# EAGLE design LabPowerSupply_CurrentModuleV1.0 (EAGLE 6.3)
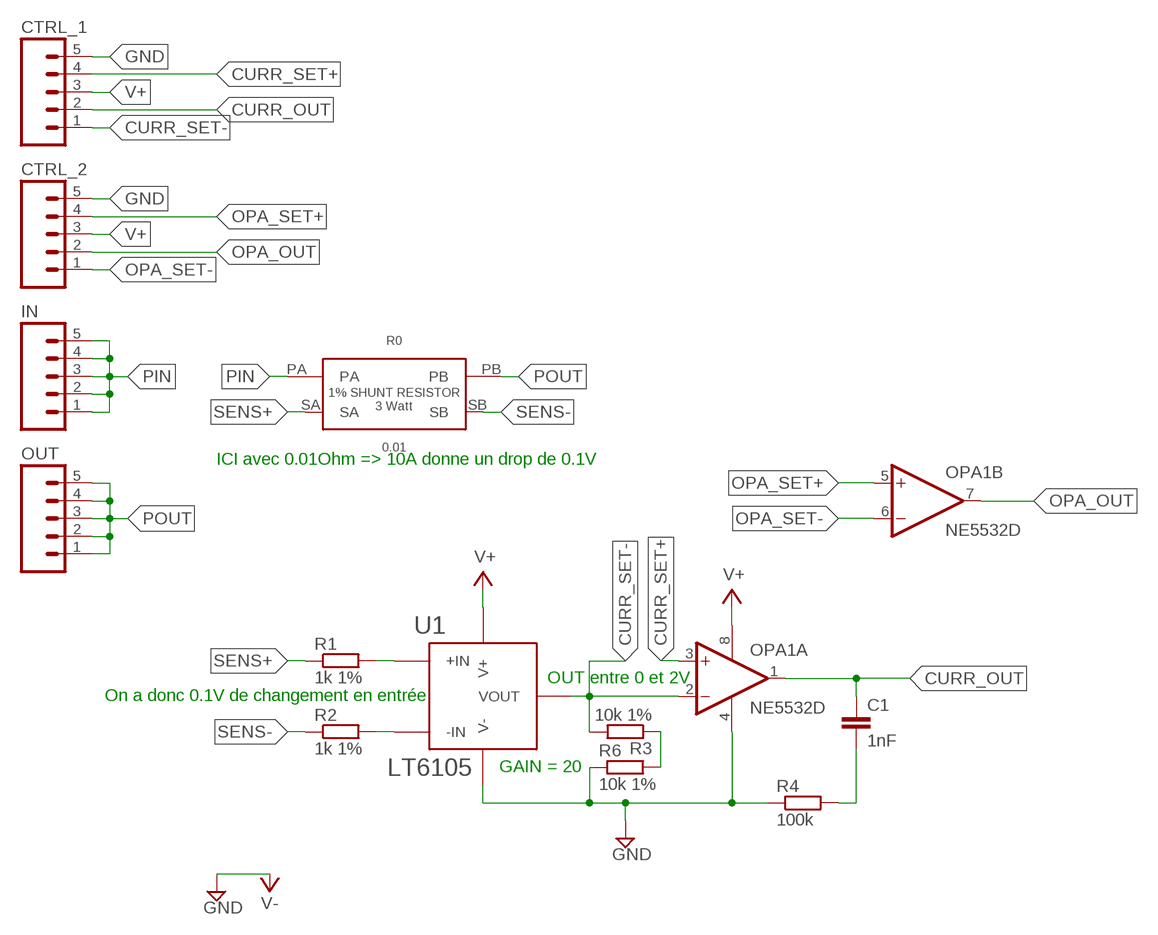
[diagram p0: schematic, sheet 1]

## Parts
C1  1nF  C-EUC1206K  [C1206K]
CTRL_1  M05PTH_LONGPADS  [1X05_LONGPADS]
CTRL_2  M05PTH_LONGPADS  [1X05_LONGPADS]
IN  M05PTH_LONGPADS  [1X05_LONGPADS]
OPA1  NE5532D  [SO08]
OUT  M05PTH_LONGPADS  [1X05_LONGPADS]
R0  0.01  WSL3637R0100FEA  [3637R]
R1  1k 1%  R-EU_R1206  [R1206]
R2  1k 1%  R-EU_R1206  [R1206]
R3  10k 1%  R-EU_R1206  [R1206]
R4  100k  R-EU_R1206  [R1206]
R6  10k 1%  R-EU_R1206  [R1206]
U1  LT6105  LT6105_MSOP_8  [MSOP_8]

## Nets
CURR_OUT: C1.1 CTRL_1.2 OPA1.1(A:OUT)
CURR_SET+: CTRL_1.4 OPA1.3(A:+IN)
CURR_SET-: CTRL_1.1 OPA1.2(A:-IN) R3.2 U1.5(VOUT)
GND: CTRL_1.5 CTRL_2.5 OPA1.4(P:V-) R4.1 R6.1 U1.4(V-) ; supply symbol labelled V-
N$2: R1.2 U1.8(+IN)
N$3: R2.2 U1.1(-IN)
N$5: C1.2 R4.2
N$7: R3.1 R6.2
OPA_OUT: CTRL_2.2 OPA1.7(B:OUT)
OPA_SET+: CTRL_2.4 OPA1.5(B:+IN)
OPA_SET-: CTRL_2.1 OPA1.6(B:-IN)
PIN: IN.1 IN.2 IN.3 IN.4 IN.5 R0.PA
POUT: OUT.1 OUT.2 OUT.3 OUT.4 OUT.5 R0.PB
SENS+: R0.SA R1.1
SENS-: R0.SB R2.1
V+: CTRL_1.3 CTRL_2.3 OPA1.8(P:V+) U1.2(V+)

## Notes on the sheet
- ICI avec 0.01Ohm => 10A donne un drop de 0.1V
- OUT entre 0 et 2V
- On a donc 0.1V de changement en entrée
- GAIN = 20

## Library data of the parts
C1 = rcl:C-EU: CAPACITOR, European symbol
CTRL_1 CTRL_2 IN OUT = SparkFun-Connectors:M05: Header 5 Standard 5-pin 0.1" header. Use with straight break away headers (SKU : PRT-00116), right angle break away headers (PRT-00553), swiss pins (PRT-00743), machine pins (PRT-00117), and female headers (PRT-00115). Molex polarized connector foot print use with SKU : PRT-08230 with associated crimp pins and housings.
OPA1 = linear:NE5532: AUDIO AMPLIFIER
R0 = LabPowerSupplyComponents:WSL3637R0100FEA
R1-R4 R6 = rcl:R-EU_: RESISTOR, European symbol
U1 = LabPowerSupplyComponents:LT6105_MSOP_8: LT6105 MSOP 8 pins package Precision, Extended Input Range Current Sense Ampliﬁ er

## Board
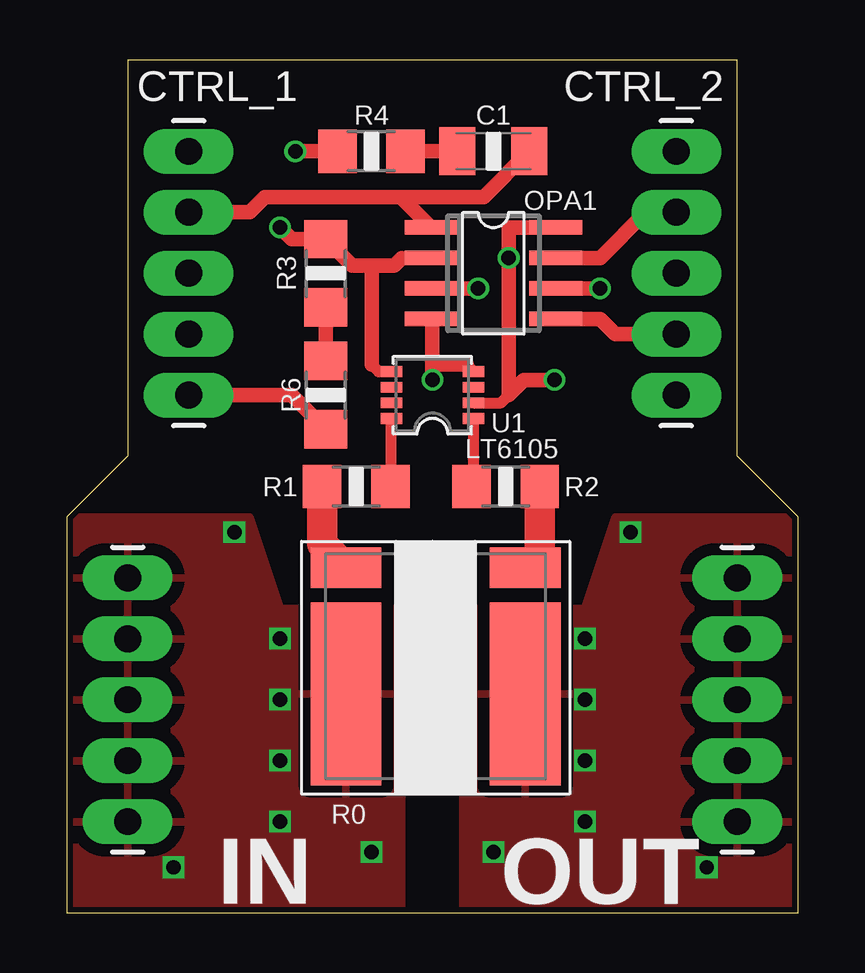
[diagram p1: board, top side]
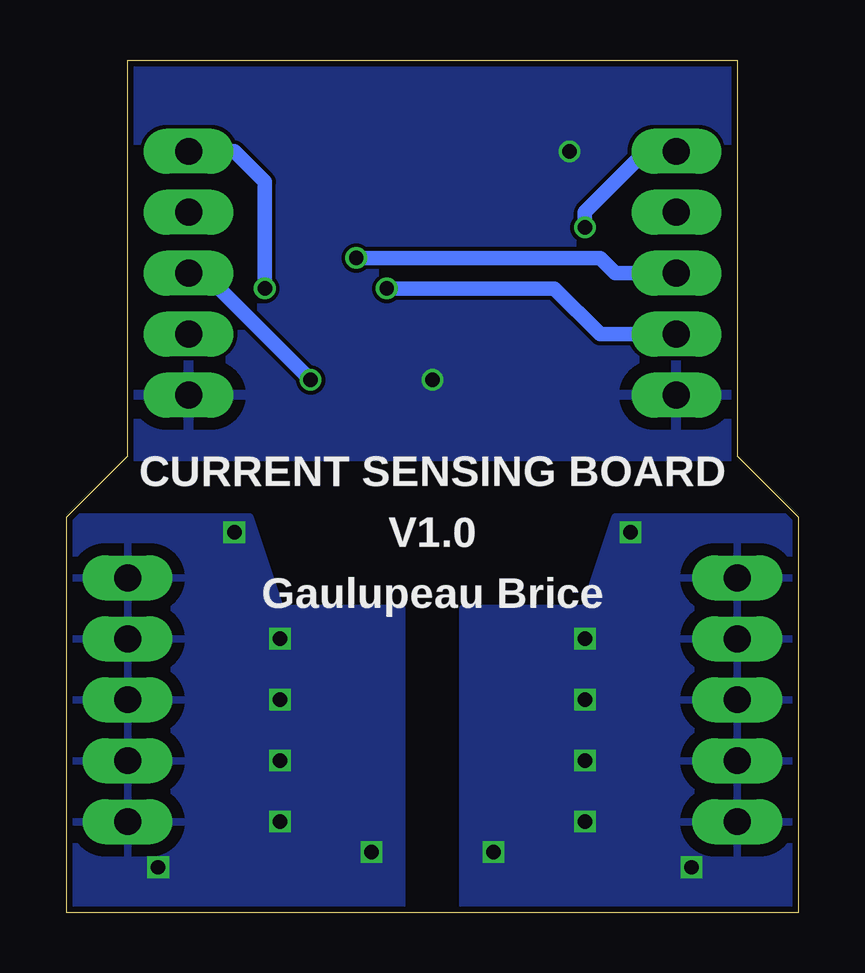
[diagram p2: board, bottom side, seen from below]

Size 30.48 x 35.56 mm. Coordinates in mm from the lower left corner, seen from the top.
Outline: 0,0 30.48,0 30.48,16.51 27.94,19.05 27.94,35.56 2.54,35.56 2.54,19.05 0,16.51 0,0
Copper layers (1*16): Top 0.035mm / dielectric 1.5mm / Bottom 0.035mm
Design rules "ITEADstudio_DRC_restrict": minimum track width 6mil, minimum drill 12mil, track to track 6mil, track to pad 6mil, pad to pad 6mil, via to via 6mil, smd to smd 0mil, copper to edge 10mil, drill to drill 10mil, minimum pad ring 10mil, minimum via ring 6mil, stop-mask expansion 2mil, vias tented up to drill 100mil, thermal gap 20mil

### Footprints (pad centres in the part's own frame; a part is rotated, then mirrored left to right if it is on the bottom)
C1206K = smd 1.5 x 2: 1 -1.5,0; 2 1.5,0
1X05_LONGPADS = drill 1.118 pad 1.88 long: 1 0,0; 2 2.54,0; 3 5.08,0; 4 7.62,0; 5 10.16,0
SO08 = smd 0.6 x 2.2: 1 -1.905,-2.6; 2 -0.635,-2.6; 3 0.635,-2.6; 4 1.905,-2.6; 5 1.905,2.6; 6 0.635,2.6; 7 -0.635,2.6; 8 -1.905,2.6
3637R = smd 2.95 x 7.62: PA -3.605,-1.02; PB 3.865,-1.02 | smd 2.95 x 1.68: SA -3.605,4.24; SB 3.865,4.24
R1206 = smd 1.6 x 1.803: 1 -1.422,0; 2 1.422,0
MSOP_8 = smd 0.9 x 0.45: 1 -1.715,0.975; 2 -1.715,0.325; 3 -1.715,-0.325; 4 -1.715,-0.975; 5 1.715,-0.975; 6 1.715,-0.325; 7 1.715,0.325; 8 1.715,0.975

### Placement (x,y rotation side)
C1  17.78,31.75 180 top
CTRL_1  5.08,31.75 270 top
CTRL_2  25.4,31.75 270 top
IN  2.54,3.81 90 top
OPA1  17.78,26.67 270 top
OUT  27.94,3.81 90 top
R0  15.24,10.16 0 top
R1  12.06,17.78 0 top
R2  18.29,17.78 180 top
R3  10.79,26.67 90 top
R4  12.7,31.75 0 top
R6  10.79,21.59 90 top
U1  15.24,21.59 180 top

### Tracks (layer width: path | path; a pad name or v marks a point on that pad's centre or on a via)
CURR_OUT
  Top 0.61: OPA1.1 13.91,29.84 | 13.91,29.84 8.26,29.84 7.62,29.21 CTRL_1.2 | C1.1 17.38,29.84 13.91,29.84
CURR_SET+  (via drill 0.6)
  Top 0.61: OPA1.3 v17.14,26.04
  Bottom 0.61: v17.14,26.04 10.16,26.04 8.26,24.13 CTRL_1.4
CURR_SET-  (via drill 0.6)
  Top 0.406: 13.97,27.3 OPA1.2
  Top 0.457: U1.5 12.99,22.57 12.7,22.86
  Top 0.61: 13.97,27.3 13.65,26.99 12.7,26.99 | 12.7,26.99 11.9,26.99 R3.2 9.37,28.09 v8.89,28.57 | 12.7,22.86 12.7,26.99
  Bottom 0.61: v8.89,28.57 8.89,29.21 6.35,31.75 CTRL_1.1
GND  (via drill 0.6)
  Top 0.406: OPA1.4 15.24,24.7
  Top 0.457: U1.4 16.66,22.86
  Top 0.61: 15.24,24.7 15.24,22.86 | 15.24,22.86 v15.24,22.23 | 16.66,22.86 15.24,22.86 | R4.1 v9.53,31.75 | R6.1 9.37,21.59 CTRL_1.5
  pour Bottom: 1.27,35.56 29.21,35.56 29.21,19.05 1.27,19.05
N$2
  Top 0.406: R1.2 13.53,17.82
  Top 0.457: 13.53,17.82 U1.8
N$3
  Top 0.406: R2.2 16.95,17.82
  Top 0.457: 16.95,17.82 U1.1
N$5
  Top 0.61: R4.2 C1.2
N$7
  Top 0.61: R6.2 R3.1
OPA_OUT
  Top 0.61: OPA1.7 22.23,27.3 24.13,29.21 CTRL_2.2
OPA_SET+
  Top 0.61: OPA1.5 22.23,24.77 22.86,24.13 CTRL_2.4
OPA_SET-  (via drill 0.6)
  Top 0.61: OPA1.6 v22.23,26.04
  Bottom 0.61: v22.23,26.04 22.23,30.48 23.5,31.75 CTRL_2.1
PIN  (via drill 0.6)
  other vias: 8.89,11.43 8.89,8.89 8.89,6.35 8.89,3.81 12.7,2.54 6.99,15.88 4.45,1.91
  pour Bottom: 0,16.51 7.62,16.51 8.89,12.7 13.97,12.7 13.97,-1.27 0,-1.27
  pour Top: 0,16.51 7.62,16.51 8.89,12.7 13.97,12.7 13.97,-1.27 0,-1.27
POUT  (via drill 0.6)
  other vias: 21.59,11.43 21.59,8.89 21.59,6.35 21.59,3.81 17.78,2.54 23.5,15.88 26.67,1.91
  pour Bottom: 16.51,12.7 21.59,12.7 22.86,16.51 30.48,16.51 30.48,-1.27 16.51,-1.27
  pour Top: 16.51,12.7 21.59,12.7 22.86,16.51 30.48,16.51 30.48,-1.27 16.51,-1.27
SENS+
  Top 1.27: R0.SA 10.64,15.39 R1.1
SENS-
  Top 1.27: R2.1 19.71,15.01 R0.SB
V+  (via drill 0.6)
  Top 0.457: U1.2 18.09,21.27 18.41,21.59
  Top 0.61: OPA1.8 18.41,28.57 v18.41,27.3 18.41,21.59 19.05,22.23 v20.32,22.23
  Bottom 0.61: CTRL_2.3 24.77,26.67 v20.32,22.23 | CTRL_1.3 7.62,26.67 8.26,27.3 v18.41,27.3

### Text on the board
bNames: CURRENT SENSING BOARD | V1.0 | Gaulupeau Brice